# EAGLE design led (EAGLE 6.5.0)
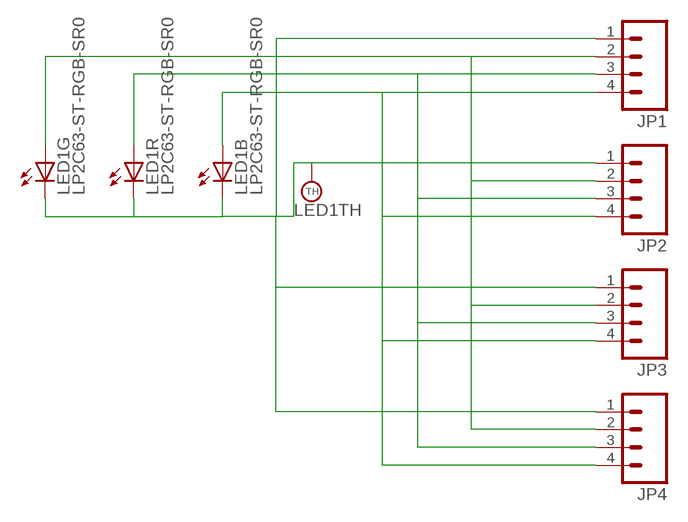
[diagram p0: schematic, sheet 1]

## Parts
JP1  M04LONGPADS  [1X04_LONGPADS]
JP2  M04LONGPADS  [1X04_LONGPADS]
JP3  M04LONGPADS  [1X04_LONGPADS]
JP4  M04LONGPADS  [1X04_LONGPADS]
LED1  LP2C63-ST-RGB-SR0  [LP2C63-ST-RGB-SR0]

## Nets
GND: JP1.1 JP2.1 JP3.1 JP4.1 LED1.4(B:C) LED1.5(R:C) LED1.6(G:C)
N$1: JP1.4 JP2.4 JP3.4 JP4.4 LED1.3(B:A)
N$2: JP1.3 JP2.3 JP3.3 JP4.3 LED1.2(R:A)
N$3: JP1.2 JP2.2 JP3.2 JP4.2 LED1.1(G:A)
Unconnected: LED1.TH(TH:TH)

## Library data of the parts
JP1-JP4 = SparkFun-Connectors:M04: Header 4 Standard 4-pin 0.1" header. Use with straight break away headers (SKU : PRT-00116), right angle break away headers (PRT-00553), swiss pins (PRT-00743), machine pins (PRT-00117), and female headers (PRT-00115). Molex polarized connector foot print use with SKU : PRT-08231 with associated crimp pins and housings. 1MM SMD Version SKU: PRT-10208
LED1 = led:LP2C63-ST-RGB-SR0: 1.5W RGB HIGH POWER LED Source: http://www.ledtech.com.tw .. LP2C63-ST-RGB-SR0.SPEC.pdf

## Board
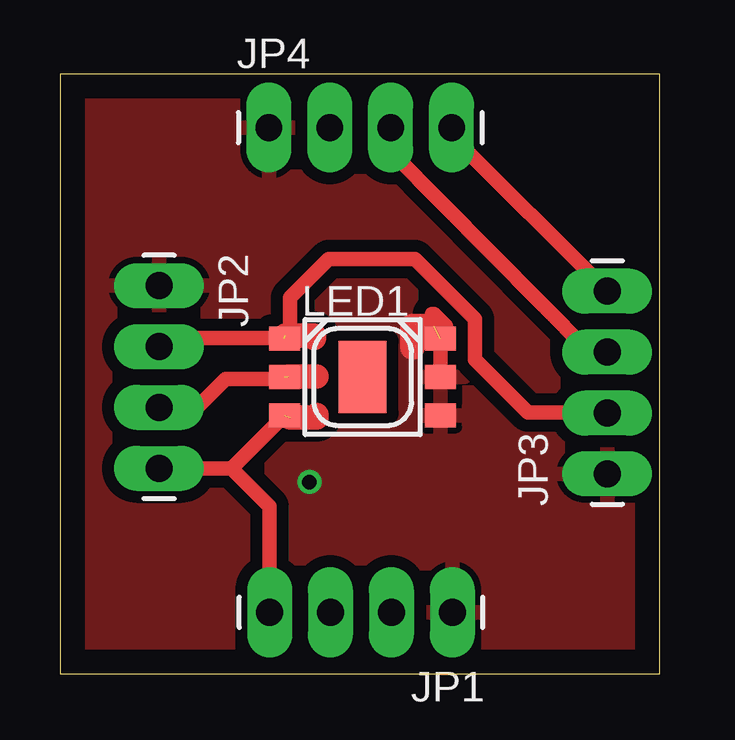
[diagram p1: board, top side]
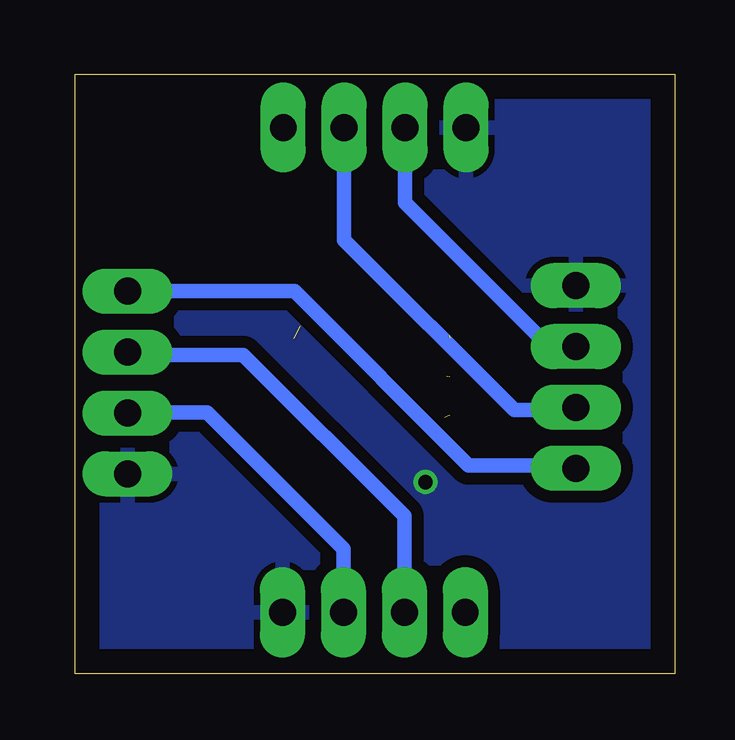
[diagram p2: board, bottom side, seen from below]

Size 25 x 25 mm. Coordinates in mm from the lower left corner, seen from the top.
Outline: 0,0 25,0 25,25 0,25 0,0
Copper layers (1*16): Top 0.1mm / dielectric 1.5mm / Bottom 0.1mm
Design rules "ensea": minimum track width 0.5mm, minimum drill 0.5mm, track to track 0.5mm, track to pad 0.5mm, pad to pad 0.5mm, via to via 0.5mm, smd to smd 8mil, copper to edge 40mil, drill to drill 8mil, minimum pad ring 10mil, minimum via ring 8mil, stop-mask expansion 4mil, vias tented up to drill 0mil, thermal gap 10mil

### Footprints (pad centres in the part's own frame; a part is rotated, then mirrored left to right if it is on the bottom)
1X04_LONGPADS = drill 1.118 pad 1.88 long: 1 0,0; 2 2.54,0; 3 5.08,0; 4 7.62,0
LP2C63-ST-RGB-SR0 = smd 1.3 x 1: 1 -3.25,1.6; 2 -3.25,0; 3 -3.25,-1.6; 4 3.25,-1.6; 5 3.25,0; 6 3.25,1.6 | smd 2 x 3: TH 0,0

### Placement (x,y rotation side)
JP1  16.36,2.57 180 top
JP2  4.13,16.19 270 top
JP3  22.82,8.34 90 top
JP4  8.71,22.78 0 top
LED1  12.62,12.38 0 top

### Tracks (layer width: path | path; a pad name or v marks a point on that pad's centre or on a via)
GND  (via drill 0.6)  (1 unrouted)
  Top 0.61: LED1.6 LED1.5 | JP4.1 9.01,21.76
  Top 1.016: 15.6,14.5 14.7,14.5 14.7,13.6
  other vias: 10.4,8
  pour Top: -1,26.7 27.2,26.7 27.2,-1.2 -1,-1.2
  pour Bottom: -3.2,27.6 30.3,27.6 30.3,-5.6 -3.2,-5.6
N$1  (1 unrouted)
  Top 0.61: JP2.4 7.16,8.57 | 7.16,8.57 LED1.3 | JP1.4 8.74,6.99 7.16,8.57 | JP4.4 16.33,22.45 JP3.4
  Top 1.016: 9.6,10.7 10.7,10.7 10.7,10.8
  Bottom 0.61: JP3.4 15.86,15.96 8.6,8.7 4.26,8.7 JP2.4
N$2  (1 unrouted)
  Top 0.61: JP2.3 5.71,11.11 6.9,12.3 9.29,12.3 LED1.2 | JP3.3 22.07,13.42 13.89,21.7 JP4.3
  Top 1.016: 9.5,12.4 10.7,12.4
  Bottom 0.61: JP4.3 13.79,18.09 6.7,11 2.74,11 JP2.3 | JP1.3 11.28,6.58 18,13.3 22.7,13.3 JP3.3
N$3  (1 unrouted)
  Top 0.61: JP2.2 5.25,13.65 5.6,14 9.35,14 LED1.1 9.6,14.21 9.6,15.7 11.2,17.3 14.8,17.3 17.3,14.8 17.3,13.1 19.5,10.9 22.8,10.9 JP3.2
  Top 1.016: 9.4,14.1 10.6,14.1 10.6,14
  Bottom 0.61: JP4.2 11.25,19.65 5.6,14 2.98,14 JP2.2 | JP1.2 13.82,5.22 19.5,10.9 22.8,10.9 JP3.2
N$5
  Top 0.61: 15.6,14.2 15.5,14.2 15.5,14.9
N$6
  Top 0.61: 15.5,15 15.6,15 16.1,14.5